# EasyEDA Pro project ProPrj_stm32G474_PPO_Display_2026-02-25.epro

# Schematic Schematic1
Board Name: Board1; Create Date: 2026-02-11; Page Name: P1; Project Name: stm32G474_PPO_Display; Schematic Name: Schematic1; Update Date: 2026-02-24; Company: EasyEDA.com; Page Size: A4; Version: V1.0
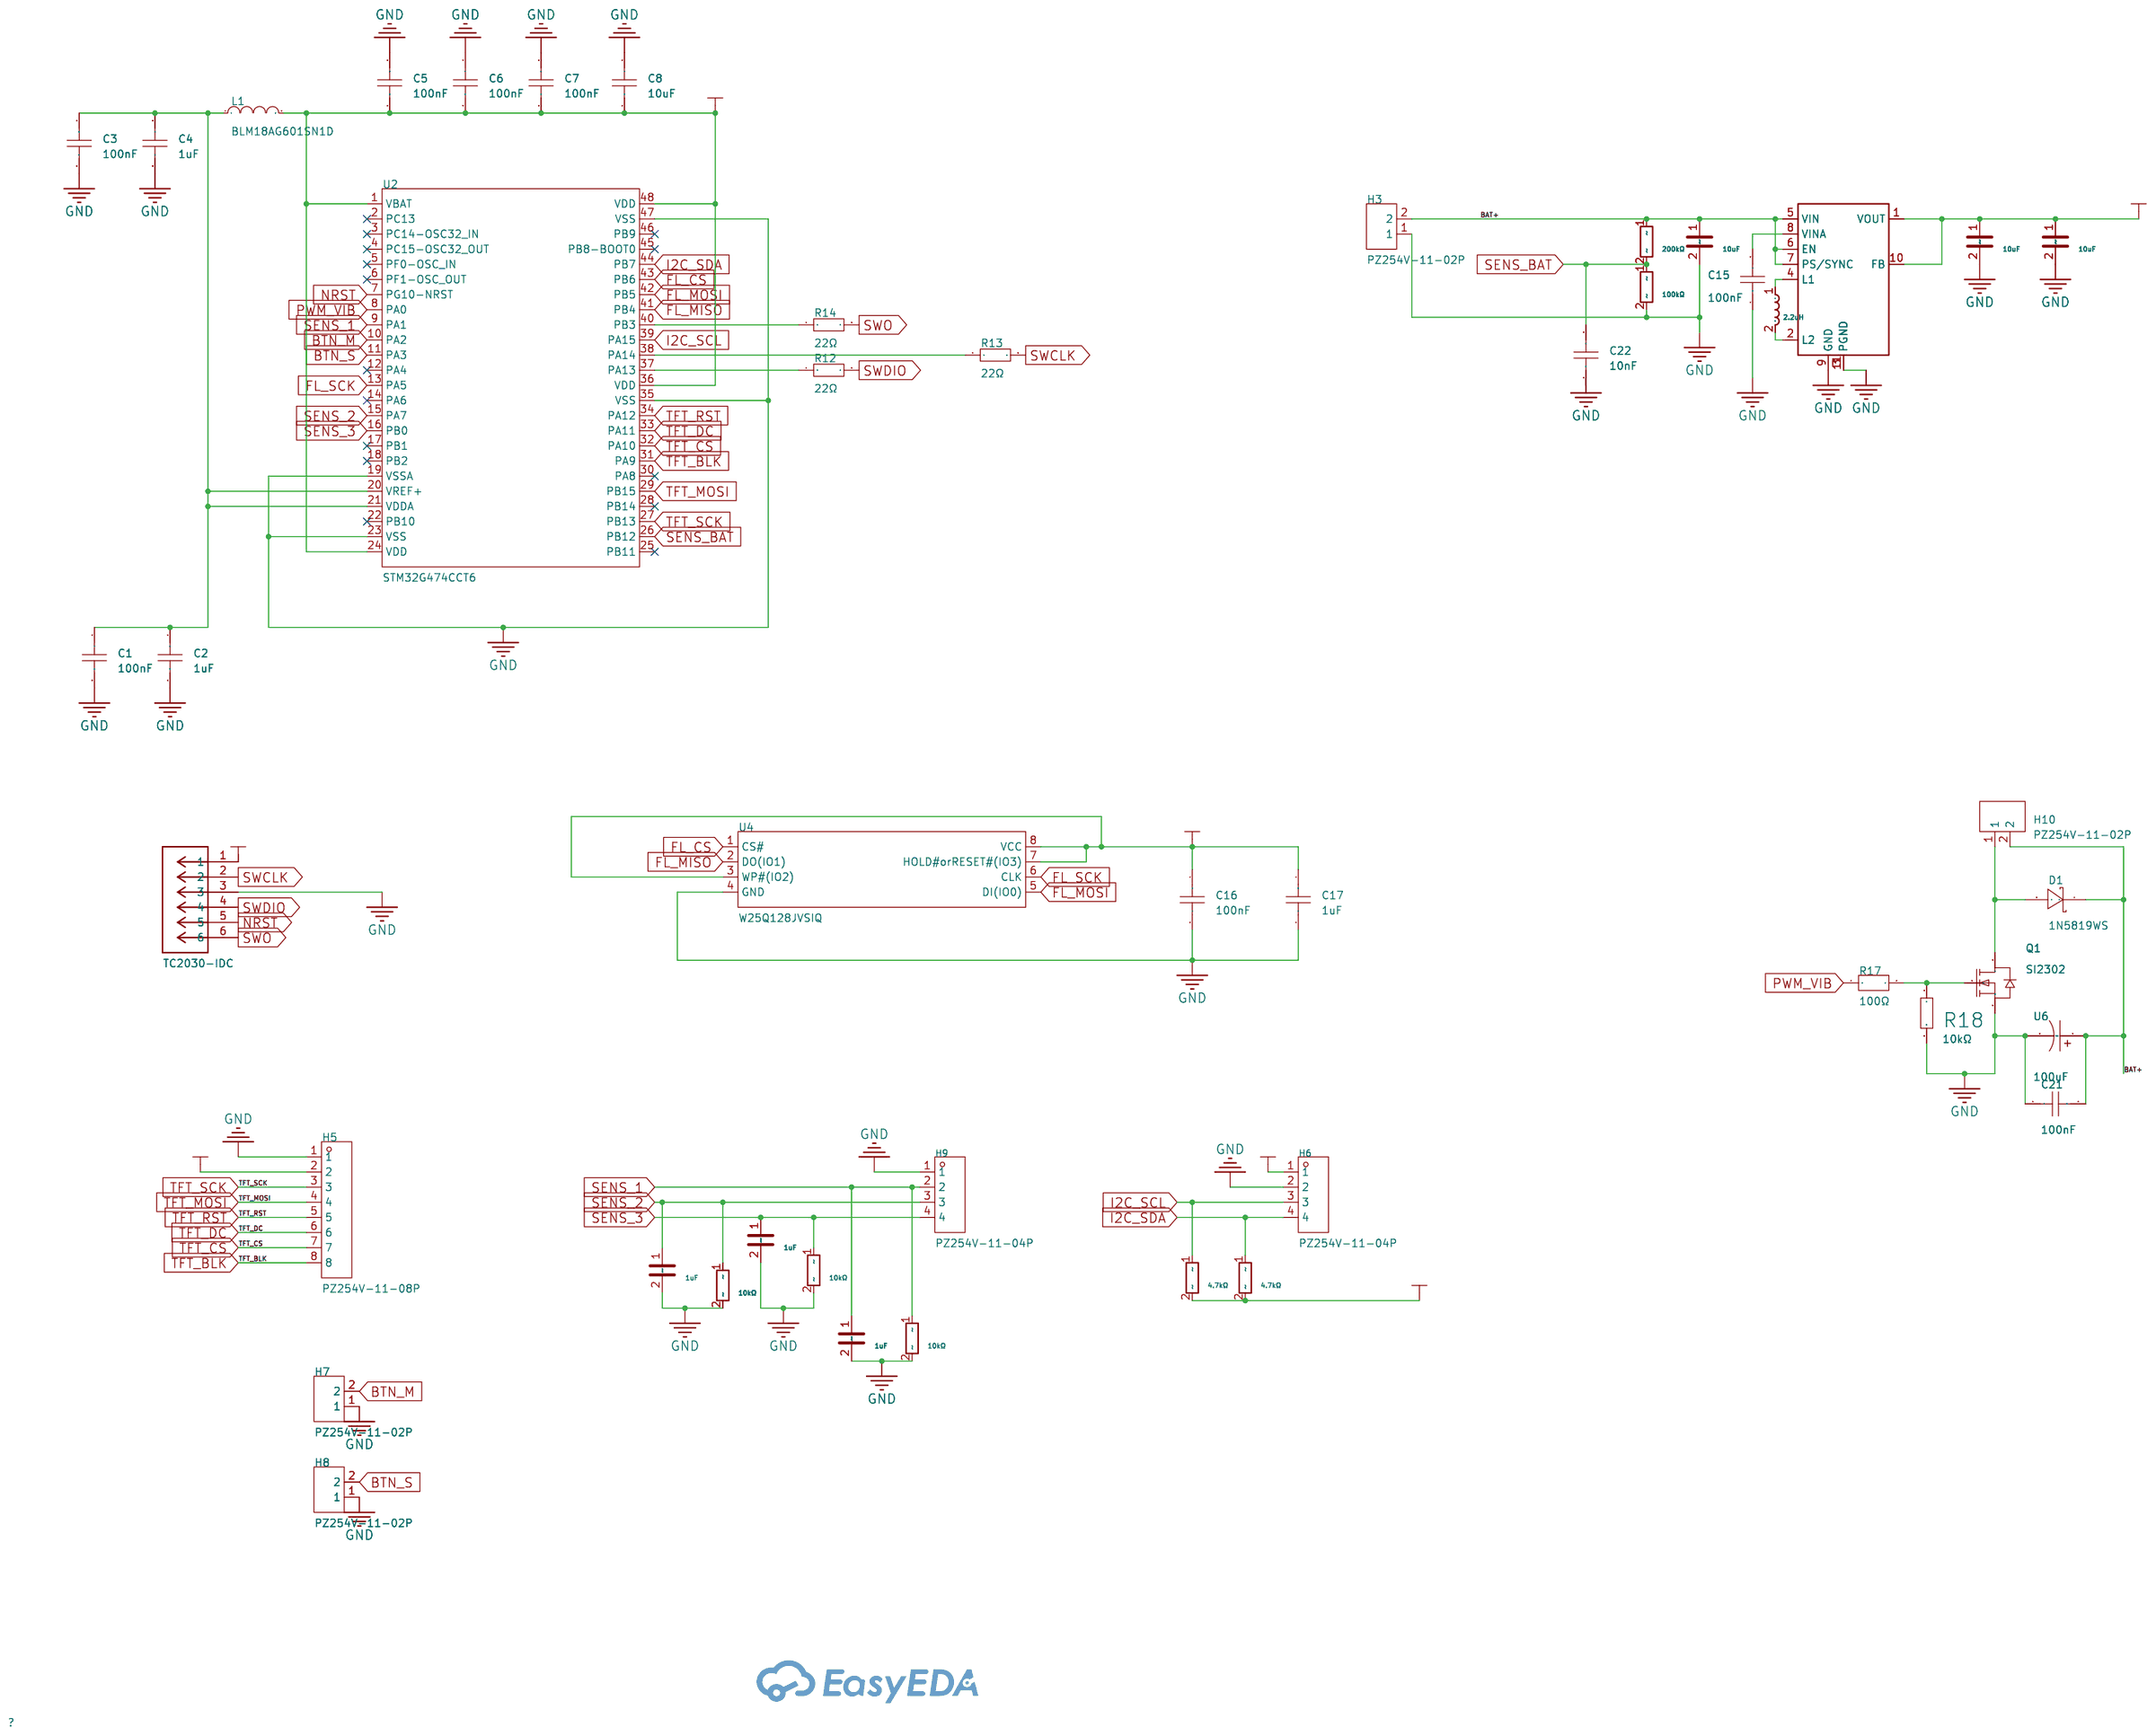
[diagram p0: schematic sheet]

## Parts
C1  100nF  [C0603]
C2  1uF  [C0603]
C3  100nF  [C0603]
C4  1uF  [C0603]
C5  100nF  [C0603]
C6  100nF  [C0603]
C7  100nF  [C0603]
C8  10uF  [C0603]
C9  1uF  [C0603]
C10  10uF  [C0603]
C11  10uF  [C0603]
C15  100nF  [C0603]
C16  100nF  [C0603]
C17  1uF  [C0603]
C18  10uF  [C0603]
C19  1uF  [C0603]
C20  1uF  [C0603]
C21  100nF  [C0603]
C22  10nF  [C0603]
D1  1N5819WS  [SOD-323_L1.8-W1.3-LS2.5-RD]
H3  PZ254V-11-02P  [HDR-TH_2P-P2.54-V-M]  (no BOM)
H5  PZ254V-11-08P  [HDR-TH_8P-P2.54-V-M]  (no BOM)
H6  PZ254V-11-04P  [HDR-TH_4P-P2.54-V-M]  (no BOM)
H7  PZ254V-11-02P  [HDR-TH_2P-P2.54-V-M]  (no BOM)
H8  PZ254V-11-02P  [HDR-TH_2P-P2.54-V-M]  (no BOM)
H9  PZ254V-11-04P  [HDR-TH_4P-P2.54-V-M]  (no BOM)
H10  PZ254V-11-02P  [HDR-TH_2P-P2.54-V-M]  (no BOM)
L1  BLM18AG601SN1D  [L0603]
L2  2.2uH  [IND-SMD_L3.0-W3.0_LQH3NPN2R2NG0L]
Q1  SI2302  [SOT-23-3_L2.9-W1.3-P1.90-LS2.4-BR]
R7  200kΩ  [R0603]
R8  100kΩ  [R0603]
R11  10kΩ  [R0603]
R12  22Ω  [R0603]
R13  22Ω  [R0603]
R14  22Ω  [R0603]
R15  10kΩ  [R0603]
R16  10kΩ  [R0603]
R17  100Ω  [R0603]
R18  10kΩ  [R0603]
R19  4.7kΩ  [R0603]
R20  4.7kΩ  [R0603]
U2  STM32G474CCT6  [LQFP-48_L7.0-W7.0-P0.50-LS9.0-BL]
U3  TPS63031DSKR  [SON-10_L2.5-W2.5-P0.50-TL-EP]
U4  W25Q128JVSIQ  [SOIC-8_L5.3-W5.3-P1.27-LS8.0-BL]
U5  TC2030-IDC  [CONN_TC2030-IDC_TGC]
U6  100uF  [C1206]

## Library data of the parts
C1 C3 C5-C7 C15 C16 C21 = CC0603KRX7R9BB104: Capacitance:100nF Tolerance:±10% Tolerance:±10% Voltage Rating:50V Temperature Coefficient:X7R; LCSC Part Name: 100nF ±10% 50V; Supplier Part: C14663; Manufacturer: YAGEO(国巨); Supplier Footprint: 0603; JLCPCB Part Class: Basic Part; Datasheet: https://item.szlcsc.com/datasheet/CC0603KRX7R9BB104/15331.html; Supplier: LCSC; Tolerance: ±10%; Voltage Rating: 50V; Temperature Coefficient: X7R
C2 C4 C17 = CL10A105KB8NNNC: Capacitance:1uF Tolerance:±10% Tolerance:±10% Voltage Rating:50V Temperature Coefficient:X5R; LCSC Part Name: 1uF ±10% 50V; Supplier Part: C15849; Manufacturer: SAMSUNG(三星); Supplier Footprint: 0603; JLCPCB Part Class: Basic Part; Datasheet: https://item.szlcsc.com/datasheet/CL10A105KB8NNNC/16531.html; Supplier: LCSC; Tolerance: ±10%; Voltage Rating: 50V; Temperature Coefficient: X5R
C8 C10 = CL10A106MQ8NNNC: Capacitance:10uF Tolerance:±20% Tolerance:±20% Voltage Rating:6.3V Temperature Coefficient:X5R; LCSC Part Name: 10uF ±20% 6.3V; Supplier Part: C1691; Manufacturer: SAMSUNG(三星); Supplier Footprint: 0603; JLCPCB Part Class: Extended Part; Datasheet: https://item.szlcsc.com/datasheet/CL10A106MQ8NNNC/2043.html; Supplier: LCSC; Tolerance: ±20%; Voltage Rating: 6.3V; Temperature Coefficient: X5R
C9 C19 C20 = CL10B105KB8NQNC: Capacitance:1uF Tolerance:±10% Tolerance:±10% Voltage Rating:50V Temperature Coefficient:X7R; LCSC Part Name: 1uF ±10% 50V; Supplier Part: C5199872; Manufacturer: SAMSUNG(三星); Supplier Footprint: 0603; JLCPCB Part Class: Extended Part; Datasheet: https://item.szlcsc.com/datasheet/CL10B105KB8NQNC/5885909.html; Supplier: LCSC; Tolerance: ±10%; Voltage Rating: 50V; Temperature Coefficient: X7R
C11 C18 = CL10A106MA8NRNC: Capacitance:10uF Tolerance:±20% Tolerance:±20% Voltage Rating:25V Temperature Coefficient:X5R; LCSC Part Name: 10uF ±20% 25V; Supplier Part: C96446; Manufacturer: SAMSUNG(三星); Supplier Footprint: 0603; JLCPCB Part Class: Basic Part; Datasheet: https://item.szlcsc.com/datasheet/CL10A106MA8NRNC/97651.html; Supplier: LCSC; Tolerance: ±20%; Voltage Rating: 25V; Temperature Coefficient: X5R
C22 = CL10B103KB8NNNC: Capacitance:10nF Tolerance:±10% Tolerance:±10% Voltage Rating:50V Temperature Coefficient:X7R; LCSC Part Name: 10nF ±10% 50V; Supplier Part: C1589; Manufacturer: SAMSUNG(三星); Supplier Footprint: 0603; JLCPCB Part Class: Extended Part; Datasheet: https://item.szlcsc.com/datasheet/CL10B103KB8NNNC/1941.html; Supplier: LCSC; Tolerance: ±10%; Voltage Rating: 50V; Temperature Coefficient: X7R
D1 = 1N5819WS_C191023: Voltage - Forward(Vf@If):600mV@1A Voltage - DC Reverse(Vr):40V Current - Rectified:1A Non-Repetitive Peak Forward Surge Current:25A; LCSC Part Name: 电压:40V 电流:1A; Supplier Part: C191023; Manufacturer: Hottech(合科泰); Supplier Footprint: SOD-323; JLCPCB Part Class: Basic Part; Datasheet: https://item.szlcsc.com/datasheet/1N5819WS/213850.html; Supplier: LCSC; Voltage - Forward(Vf@If): 600mV@1A; Voltage - DC Reverse(Vr): 40V; Current - Rectified: 1A; Non-Repetitive Peak Forward Surge Current: 25A
H3 H7 H8 H10 = PZ254V-11-02P: Pin Structure:1x2P Pitch:2.54mm Row Spacing:- Circluar Pins/Square Pins:Pin Header Mounting Type:Through Hole Number of Rows:1 Number of Pins:2P Current Rating:- Voltage Rating (Max):- Length of Mating Pin:6mm Insulation Height:2.5mm Length of End Connect; LCSC Part Name: 1x2P 间距:2.54mm 方针 直插; Supplier Part: C492401; Manufacturer: XFCN(兴飞); Supplier Footprint: 插件,P=2.54mm; JLCPCB Part Class: Extended Part; Datasheet: https://item.szlcsc.com/datasheet/PZ254V-11-02P/502957.html; Supplier: LCSC; Pin Structure: 1x2P; Pitch: 2.54mm; Circluar Pins/Square Pins: Pin Header; Mounting Type: Through Hole; Number of Rows: 1; Number of Pins: 2P; Length of Mating Pin: 6mm; Insulation Height: 2.5mm; Length of End Connection Pin: 3mm; Contact Material: Brass; Operating Temperature: -40℃~+105℃; Color: Black
H5 = PZ254V-11-08P: Pin Structure:1x8P Pitch:2.54mm Row Spacing:- Circluar Pins/Square Pins:Pin Header Mounting Type:Through Hole Number of Rows:1 Number of Pins:8P Current Rating:- Voltage Rating (Max):- Length of Mating Pin:6mm Insulation Height:2.5mm Length of End Connect; LCSC Part Name: 1x8P 间距:2.54mm 方针 直插; Supplier Part: C492407; Manufacturer: XFCN(兴飞); Supplier Footprint: 插件,P=2.54mm; JLCPCB Part Class: Extended Part; Datasheet: https://item.szlcsc.com/datasheet/PZ254V-11-08P/502963.html; Supplier: LCSC; Pin Structure: 1x8P; Pitch: 2.54mm; Circluar Pins/Square Pins: Pin Header; Mounting Type: Through Hole; Number of Rows: 1; Number of Pins: 8P; Length of Mating Pin: 6mm; Insulation Height: 2.5mm; Length of End Connection Pin: 3mm; Contact Material: Brass; Operating Temperature: -40℃~+105℃; Color: Black
H6 H9 = PZ254V-11-04P: Pin Structure:1x4P Pitch:2.54mm Row Spacing:- Circluar Pins/Square Pins:Pin Header Mounting Type:Through Hole Number of Rows:1 Number of Pins:4P Current Rating:3A Voltage Rating (Max):250V Length of Mating Pin:6mm Insulation Height:2.5mm Length of End Con; LCSC Part Name: 1x4P 间距:2.54mm 方针 直插; Supplier Part: C2691448; Manufacturer: XFCN(兴飞); Supplier Footprint: 插件,P=2.54mm; JLCPCB Part Class: Extended Part; Datasheet: https://item.szlcsc.com/datasheet/PZ254V-11-04P/2801085.html; Supplier: LCSC; Pin Structure: 1x4P; Pitch: 2.54mm; Circluar Pins/Square Pins: Pin Header; Mounting Type: Through Hole; Number of Rows: 1; Number of Pins: 4P; Current Rating: 3A; Voltage Rating (Max): 250V; Length of Mating Pin: 6mm; Insulation Height: 2.5mm; Length of End Connection Pin: 3mm; Operating Temperature: -40℃~+105℃; Color: Black
L1 = BLM18AG601SN1D: Impedance @ Frequency:600Ω@100MHz Tolerance:±25% Tolerance:±25% DC Resistance(DCR):380mΩ Current Rating:500mA Number of Circuits:1 Operating Temperature:-55℃~+125℃ Operating Temperature:-55℃~+125℃; LCSC Part Name: 单路 0603磁珠 阻抗600Ω@100MHz; Supplier Part: C19330; Manufacturer: muRata(村田); Supplier Footprint: 0603; JLCPCB Part Class: Extended Part; Datasheet: https://item.szlcsc.com/datasheet/BLM18AG601SN1D/20038.html; Supplier: LCSC; Impedance @ Frequency: 600Ω@100MHz; Tolerance: ±25%; DC Resistance(DCR): 380mΩ; Current Rating: 500mA; Number of Circuits: 1; Operating Temperature: -55℃~+125℃
L2 = LQH3NPN2R2MMEL: Inductance: Tolerance:±20% Tolerance:±20% Rated Current:1.22A Saturation Current (Isat):1.8A DC Resistance (DCR): Q @ Freq:- Frequency - Self Resonant: Ratings:; LCSC Part Name: 2.2uH ±20% 1.8A; Supplier Part: C668451; Manufacturer: muRata(村田); Supplier Footprint: SMD,3x3mm; JLCPCB Part Class: Extended Part; Datasheet: https://atta.szlcsc.com/upload/public/pdf/source/20191022/C440248_094C93E028FCF0FA66FA57BC1ADCD3EF.pdf; Supplier: LCSC; Tolerance: ±20%; Rated Current: 1.22A; Saturation Current (Isat): 1.8A
Q1 = SI2302_C20628873: Number:1 N-Channel Drain to Source Voltage:20V Current - Continuous Drain(Id):3.3A RDS(on):75mΩ@2.5V Pd - Power Dissipation:1W Gate Threshold Voltage (Vgs(th)):1.5V@250uA Type:N-Channel; LCSC Part Name: 1个N沟道 耐压:20V 电流:3.3A; Supplier Part: C20628873; Manufacturer: FOSAN(富捷/富信); Supplier Footprint: SOT-23; JLCPCB Part Class: Extended Part; Datasheet: https://item.szlcsc.com/datasheet/SI2302/22043121.html; Supplier: LCSC; Number: 1 N-Channel; Drain to Source Voltage: 20V; Current - Continuous Drain(Id): 3.3A; RDS(on): 75mΩ@2.5V; Pd - Power Dissipation: 1W; Gate Threshold Voltage (Vgs(th)): 1.5V@250uA; Type: N-Channel
R7 = 0603WAF2003T5E: Type:Thick Film Resistors Resistance:200kΩ Tolerance:±1% Tolerance:±1% Power(Watts): Overload Voltage (Max): Temperature Coefficient:±100ppm/℃ Temperature Coefficient:±100ppm/℃ Operating Temperature Range:-55℃~+155℃ Operating Temperature Range:-55℃~+155℃; LCSC Part Name: 200kΩ ±1% 100mW 厚膜电阻; Supplier Part: C25811; Manufacturer: UNI-ROYAL(厚声); Supplier Footprint: 0603; JLCPCB Part Class: Basic Part; Datasheet: https://atta.szlcsc.com/upload/public/pdf/source/20200306/C422600_1E6D84923E4A46A82E41ADD87F860B5C.pdf; Supplier: LCSC; Type: Thick Film Resistors; Tolerance: ±1%; Temperature Coefficient: ±100ppm/℃; Operating Temperature Range: -55℃~+155℃
R8 = FRC0603J104 TS: Type:Thick Film Resistor Resistance:100kΩ Tolerance:±5% Tolerance:±5% Power(Watts):100mW Voltage-Supply(Max):75V Temperature Coefficient:±100ppm/℃ Temperature Coefficient:±100ppm/℃ Operating Temperature:-55℃~+155℃ Operating Temperature:-55℃~+155℃; LCSC Part Name: 100kΩ ±5% 100mW 厚膜电阻; Supplier Part: C2907088; Manufacturer: FOJAN(富捷); Supplier Footprint: 0603; JLCPCB Part Class: Extended Part; Supplier: LCSC; Type: Thick Film Resistor; Tolerance: ±5%; Power(Watts): 100mW; Voltage-Supply(Max): 75V; Temperature Coefficient: ±100ppm/℃; Operating Temperature: -55℃~+155℃
R11 R15 R16 R18 = 0603WAF1002T5E: Type:Thick Film Resistor Resistance:10kΩ Tolerance:±1% Tolerance:±1% Power(Watts):100mW Voltage-Supply(Max):75V Temperature Coefficient:±100ppm/℃ Temperature Coefficient:±100ppm/℃ Operating Temperature:-55℃~+155℃ Operating Temperature:-55℃~+155℃; LCSC Part Name: 厚膜电阻 10kΩ ±1% 100mW; Supplier Part: C25804; Manufacturer: UNI-ROYAL(厚声); Supplier Footprint: 0603; JLCPCB Part Class: Basic Part; Datasheet: https://item.szlcsc.com/datasheet/0603WAF1002T5E/26547.html; Supplier: LCSC; Type: Thick Film Resistor; Tolerance: ±1%; Power(Watts): 100mW; Voltage-Supply(Max): 75V; Temperature Coefficient: ±100ppm/℃; Operating Temperature: -55℃~+155℃
R12-R14 = 0603WAF220JT5E: Type:Thick Film Resistors Resistance:22Ω Tolerance:±1% Tolerance:±1% Power(Watts): Overload Voltage (Max): Temperature Coefficient:±100ppm/℃ Temperature Coefficient:±100ppm/℃ Operating Temperature Range:-55℃~+155℃ Operating Temperature Range:-55℃~+155℃; LCSC Part Name: 22Ω ±1% 100mW 厚膜电阻; Supplier Part: C23345; Manufacturer: UNI-ROYAL(厚声); Supplier Footprint: 0603; JLCPCB Part Class: Basic Part; Datasheet: https://atta.szlcsc.com/upload/public/pdf/source/20200306/C422600_1E6D84923E4A46A82E41ADD87F860B5C.pdf; Supplier: LCSC; Type: Thick Film Resistors; Tolerance: ±1%; Temperature Coefficient: ±100ppm/℃; Operating Temperature Range: -55℃~+155℃
R17 = FRC0603J101 TS: Type:Thick Film Resistor Resistance:100Ω Tolerance:±5% Tolerance:±5% Power(Watts):100mW Voltage-Supply(Max):75V Temperature Coefficient:±100ppm/℃ Temperature Coefficient:±100ppm/℃ Operating Temperature:-55℃~+155℃ Operating Temperature:-55℃~+155℃; LCSC Part Name: 100Ω ±5% 100mW 厚膜电阻; Supplier Part: C2907089; Manufacturer: FOJAN(富捷); Supplier Footprint: 0603; JLCPCB Part Class: Extended Part; Supplier: LCSC; Type: Thick Film Resistor; Tolerance: ±5%; Power(Watts): 100mW; Voltage-Supply(Max): 75V; Temperature Coefficient: ±100ppm/℃; Operating Temperature: -55℃~+155℃
R19 R20 = 0603WAF4701T5E: Type:Thick Film Resistor Resistance:4.7kΩ Tolerance:±1% Tolerance:±1% Power(Watts):100mW Voltage-Supply(Max):75V Temperature Coefficient:±100ppm/℃ Temperature Coefficient:±100ppm/℃ Operating Temperature:-55℃~+155℃ Operating Temperature:-55℃~+155℃; LCSC Part Name: 4.7kΩ ±1% 100mW 厚膜电阻; Supplier Part: C23162; Manufacturer: UNI-ROYAL(厚声); Supplier Footprint: 0603; JLCPCB Part Class: Basic Part; Datasheet: https://item.szlcsc.com/datasheet/0603WAF4701T5E/23889.html; Supplier: LCSC; Type: Thick Film Resistor; Tolerance: ±1%; Power(Watts): 100mW; Voltage-Supply(Max): 75V; Temperature Coefficient: ±100ppm/℃; Operating Temperature: -55℃~+155℃
U2 = STM32G474CCT6: CPU Core:ARM-M4 CPU Maximum Speed:170MHz Program Storage Size:256KB Number of I/O:38 ADC (Bit):12bit DAC (Bit):12bit Voltage - Supply:1.71V~3.6V Voltage - Supply:1.71V~3.6V Applications:-; LCSC Part Name: 带DSP和FPU的170MHz主流ARM Cortex-M4 MCU，具有256 KB Flash存储器、数学加速器、高分辨率定时器和高模拟电平集成; Supplier Part: C730124; Manufacturer: ST(意法半导体); Supplier Footprint: LQFP-48(7x7); JLCPCB Part Class: Extended Part; Datasheet: https://item.szlcsc.com/datasheet/STM32G474CCT6/778079.html; Supplier: LCSC; CPU Core: ARM-M4; CPU Maximum Speed: 170MHz; Program Storage Size: 256KB; Number of I/O: 38; ADC (Bit): 12bit; DAC (Bit): 12bit; Voltage - Supply: 1.71V~3.6V
U3 = TPS63031DSKR: Function:Buck-Boost Voltage - Supply:1.8V~5.5V Voltage - Supply:1.8V~5.5V Output Voltage:3.3V Output Voltage:3.3V Output Current:900mA Frequency - Switching:2.4MHz Frequency - Switching:2.4MHz Operating Temperature:-40℃~+125℃@(TJ) Operating Temperature:-4; LCSC Part Name: 高效单电感降 压-升压转换器; Supplier Part: C15516; Manufacturer: TI(德州仪器); Supplier Footprint: SON-10-EP(2.5x2.5); JLCPCB Part Class: Extended Part; Datasheet: https://www.ti.com/cn/lit/gpn/tps63031; Supplier: LCSC; Function: Buck-Boost; Voltage - Supply: 1.8V~5.5V; Output Voltage: 3.3V; Output Current: 900mA; Frequency - Switching: 2.4MHz; Operating Temperature: -40℃~+125℃@(TJ); Synchronous Rectifier: Yes; Number of Outputs: 1; Topology: Buck-Boost; Quiescent Current: 25uA; Switch tube (built-in/external): Built-in; Output Type: Fixed
U4 = W25Q128JVSIQ_C113767: Interface:SPI Memory Size:- Clock Frequency:133MHz Voltage - Supply:2.7V~3.6V Voltage - Supply:2.7V~3.6V Program / Erase Cycles:100,000 Cycles Page Programming Time (Tpp):3ms Operating Temperature:- Operating Temperature:-; LCSC Part Name: 支持双路/四路SPI接口的3V、128Mbit 串行闪存; Supplier Part: C113767; Manufacturer: Winbond(华邦); Supplier Footprint: SOIC-8-208mil; JLCPCB Part Class: Extended Part; Datasheet: https://item.szlcsc.com/datasheet/W25Q128JVSIQ/115003.html; Supplier: LCSC; Interface: SPI; Clock Frequency: 133MHz; Voltage - Supply: 2.7V~3.6V; Program / Erase Cycles: 100,000 Cycles; Page Programming Time (Tpp): 3ms
U5 = TC2030-IDC
U6 = CL31A107MQHNNNE: Capacitance:100uF Tolerance:±20% Tolerance:±20% Voltage Rating:6.3V Temperature Coefficient:X5R; LCSC Part Name: 100uF ±20% 6.3V; Supplier Part: C15008; Manufacturer: SAMSUNG(三星); Supplier Footprint: 1206; JLCPCB Part Class: Basic Part; Datasheet: https://item.szlcsc.com/datasheet/CL31A107MQHNNNE/15681.html; Supplier: LCSC; Tolerance: ±20%; Voltage Rating: 6.3V; Temperature Coefficient: X5R

## Nets
GND: C1.2 C2.2 C3.2 C4.2 C5.1 C6.1 C7.1 C8.1 C9.2 C10.2 C11.2 C15.1 C16.2 C17.2 C18.2 C19.2 C20.2 C21.1 C22.1 H3.1 H5.1 H6.2 H7.1 H8.1 H9.1 Q1.2(S) R8.2 R11.2 R15.2 R16.2 R18.2 U2.19(VSSA) U2.23(VSS) U2.35(VSS) U2.47(VSS) U3.3(PGND) U3.9(GND) U3.11(PGND) U4.4(GND) U5.3 U6.2
VDD: C5.2 C6.2 C7.2 C8.2 C11.1 C16.1 C17.1 C18.1 H5.2 H6.1 L1.2 R19.2 R20.2 U2.1(VBAT) U2.24(VDD) U2.36(VDD) U2.48(VDD) U3.1(VOUT) U3.10(FB) U4.3(WP#(IO2)) U4.7(HOLD#orRESET#(IO3)) U4.8(VCC) U5.1
BAT+: C10.1 C21.2 D1.1(K) H3.2 H10.2 R7.1 U3.5(VIN) U3.6(EN) U3.7(PS/SYNC) U6.1
BTN_M: H7.2 U2.10(PA2)
BTN_S: H8.2 U2.11(PA3)
FL_CS: U2.43(PB6) U4.1(CS#)
FL_MISO: U2.41(PB4) U4.2(DO(IO1))
FL_MOSI: U2.42(PB5) U4.5(DI(IO0))
FL_SCK: U2.13(PA5) U4.6(CLK)
I2C_SCL: H6.3 R19.1 U2.39(PA15)
I2C_SDA: H6.4 R20.1 U2.44(PB7)
NRST: U2.7(PG10-NRST) U5.5
PWM_VIB: R17.1 U2.8(PA0)
SENS_1: C9.1 H9.2 R16.1 U2.9(PA1)
SENS_2: C19.1 H9.3 R11.1 U2.15(PA7)
SENS_3: C20.1 H9.4 R15.1 U2.16(PB0)
SENS_BAT: C22.2 R7.2 R8.1 U2.26(PB12)
SWCLK: R13.2 U5.2
SWDIO: R12.2 U5.4
SWO: R14.2 U5.6
TFT_BLK: H5.8 U2.31(PA9)
TFT_CS: H5.7 U2.32(PA10)
TFT_DC: H5.6 U2.33(PA11)
TFT_MOSI: H5.4 U2.29(PB15)
TFT_RST: H5.5 U2.34(PA12)
TFT_SCK: H5.3 U2.27(PB13)
$1N885: C1.1 C2.1 C3.1 C4.1 L1.1 U2.20(VREF+) U2.21(VDDA)
$1N2112: L2.2 U3.2(L2)
$1N2115: L2.1 U3.4(L1)
$1N3846: R12.1 U2.37(PA13)
$1N3850: R13.1 U2.38(PA14)
$1N3855: R14.1 U2.40(PB3)
$1N9387: Q1.1(G) R17.2 R18.1
$1N9552: D1.2(A) H10.1 Q1.3(D)
$1N11685: C15.2 U3.8(VINA)

Not connected (* = marked no-connect by the designer): U2 2(PC13)* 3(PC14-OSC32_IN)* 4(PC15-OSC32_OUT)* 5(PF0-OSC_IN)* 6(PF1-OSC_OUT)* 12(PA4)* 14(PA6)* 17(PB1)* 18(PB2)* 22(PB10)* 25(PB11)* 28(PB14)* 30(PA8)* 45(PB8-BOOT0)* 46(PB9)*

# Board PCB1
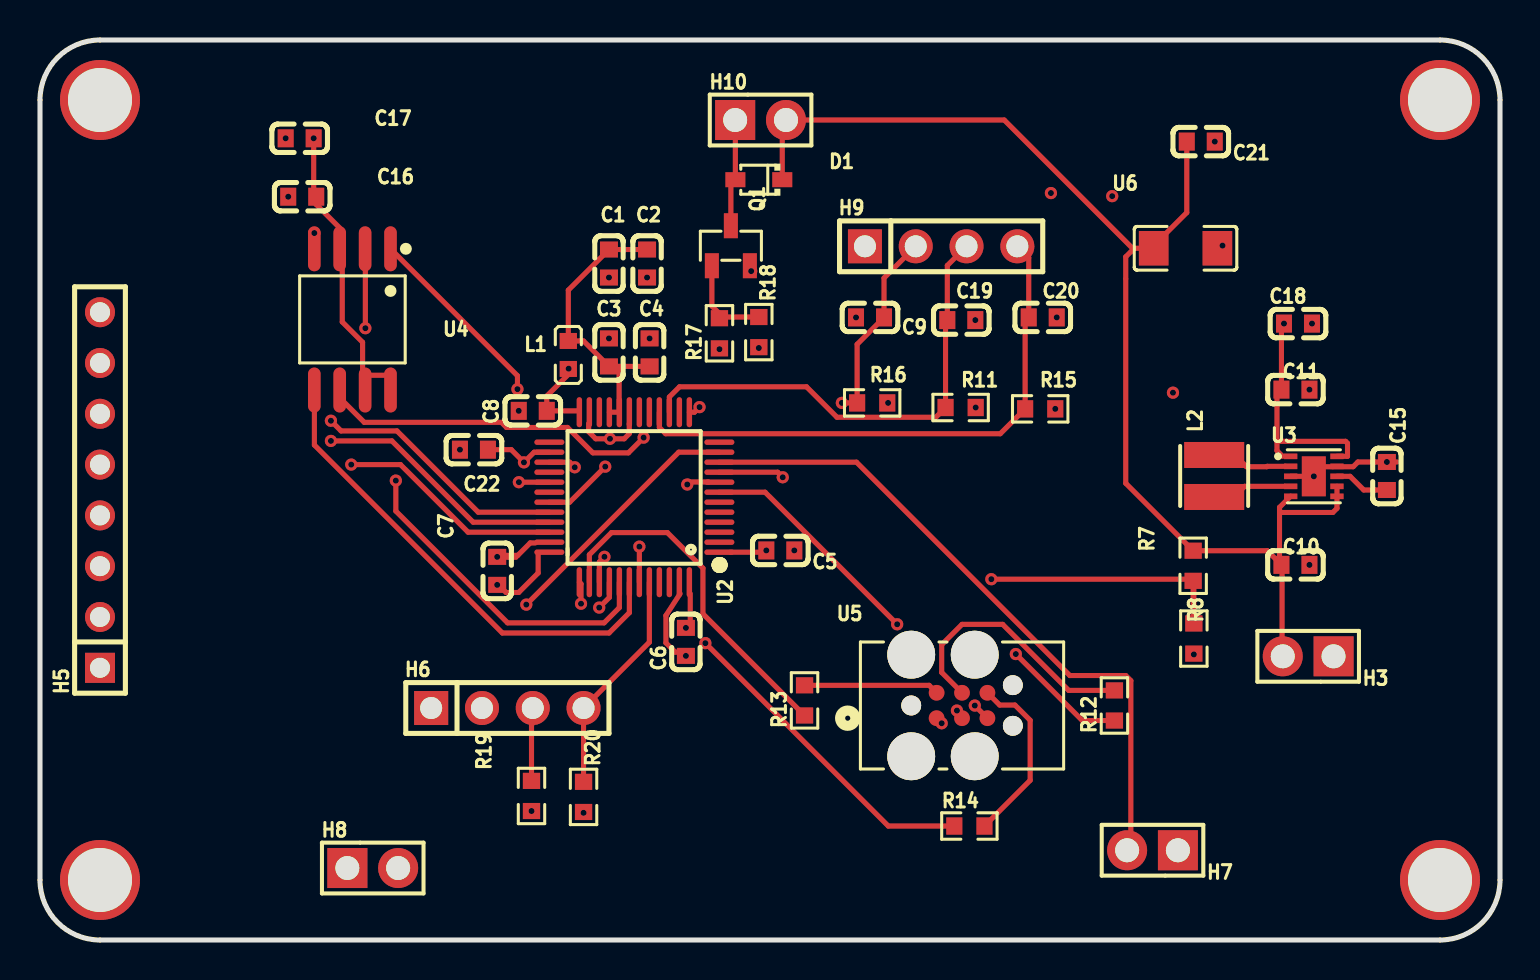
[diagram p1: board, top side]
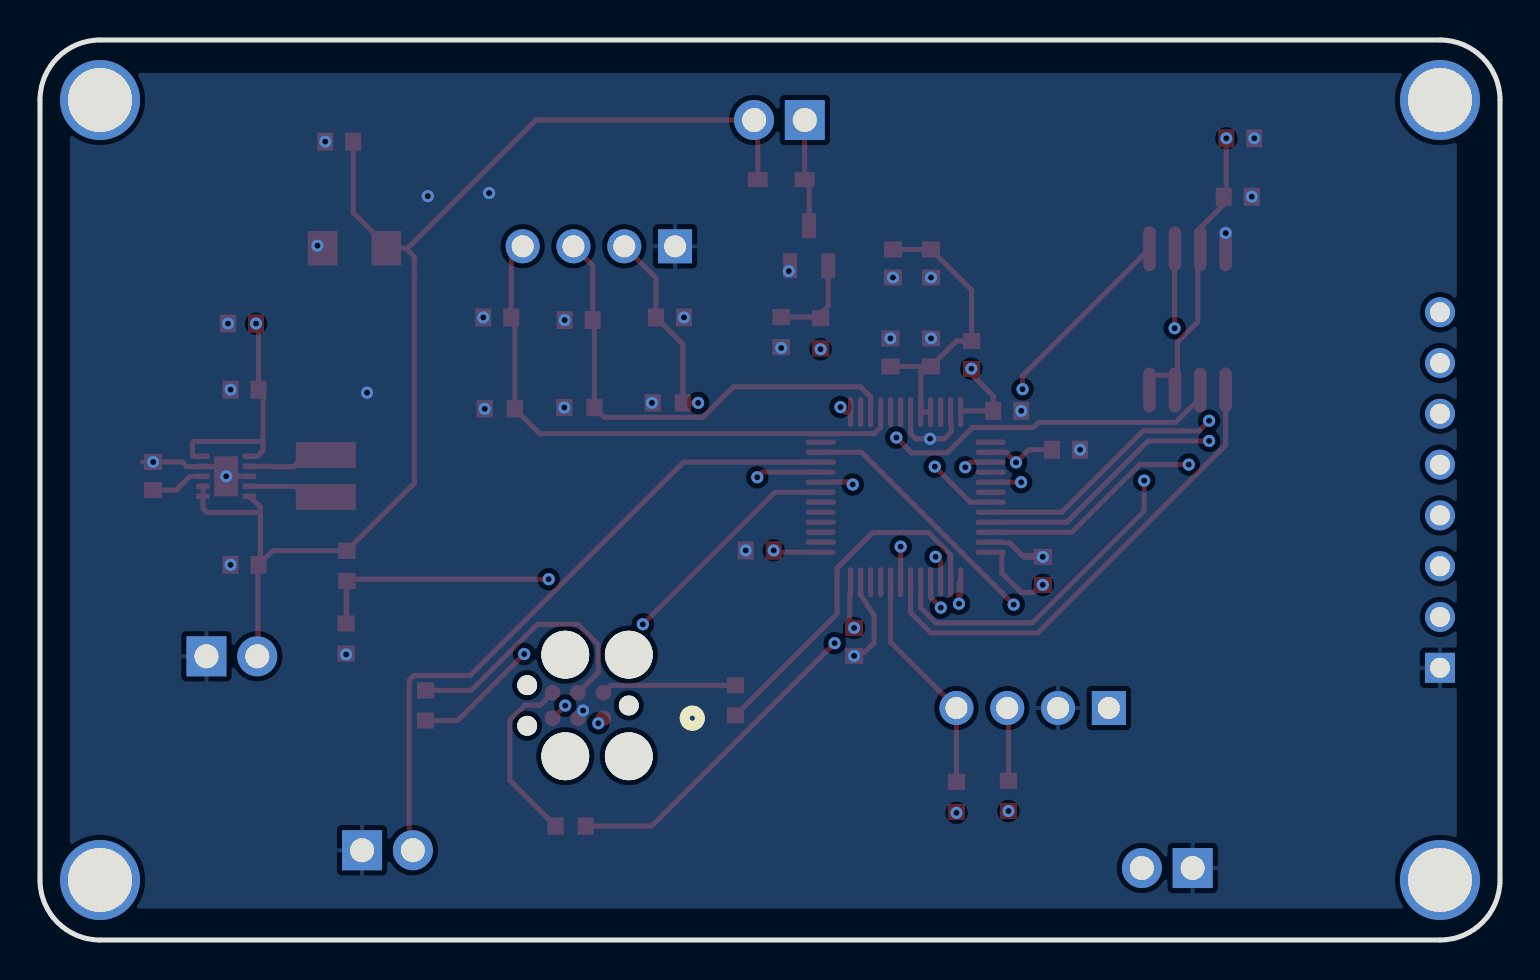
[diagram p2: board, bottom side, seen from below]

Outline 73 x 45 mm; copper layers: Top Layer, Inner1, Inner2, Bottom Layer. Coordinates in mm from the lower left corner of the outline.
Outline path: 0,42 0,3 arc(0.88,0.88) 3,0 70,0 arc(72.12,0.88) 73,3 73,42 arc(72.12,44.12) 70,45 3,45 arc(0.88,44.12) 0,42
Stack: Top Layer 0.035mm Outer layer thickness 1oz / Dielectric1 0.2104mm 7628 RC49% 8.6mil / Inner1 0.0152mm Inner layer thickness / Dielectric2 1.065mm 1.1mm H/HOZ Copper / Inner2 0.0152mm Inner layer thickness / Dielectric3 0.2104mm 7628 RC49% 8.6mil / Bottom Layer 0.035mm Outer layer thickness 1oz

## Design rules (mm)
template: JLCPCB Capability(Multiple Layers Board)
spacing copperThickness1oz (default): track to track 0.102, other pairs 0.152 to 0.3
spacing copperThickness2oz: track to track 0.203, other pairs 0.152 to 0.3
spacing copperThicknessInner0.5oz: track to track 0.089, other pairs 0.152 to 0.3
track width copperThickness1oz (default): min 0.102, default 0.254, max 2.54
track width copperThickness2oz: min 0.203, default 0.254, max 2.54
track width copperThickness0.5oz: min 0.089, default 0.254, max 2.54
differential pair differentialPair (default): width min 0.127, default 0.254, max 2.54; gap min 0.152, default 0.152
via viaSize (default): diameter min 0.3, default 0.61, max 10; hole min 0.2, default 0.305, max 6.3

## Placement (name value [footprint] x y rotation side)
C1  100nF  [C0603]  28.45 33.82 270 top
C2  1uF  [C0603]  30.35 33.82 270 top
C3  100nF  [C0603]  28.45 29.38 90 top
C4  1uF  [C0603]  30.48 29.38 90 top
C5  100nF  [C0603]  37.02 19.48 180 top
C6  100nF  [C0603]  32.29 14.91 90 top
C7  100nF  [C0603]  22.86 18.46 270 top
C8  10uF  [C0603]  24.64 26.46 0 top
C9  1uF  [C0603]  41.5 31.13 180 top
C10  10uF  [C0603]  62.77 18.76 0 top
C11  10uF  [C0603]  62.77 27.52 0 top
C15  100nF  [C0603]  67.34 23.2 270 top
C16  100nF  [C0603]  13.11 37.16 180 top
C17  1uF  [C0603]  12.98 40.09 180 top
C18  10uF  [C0603]  62.9 30.82 0 top
C19  1uF  [C0603]  46.07 31 0 top
C20  1uF  [C0603]  50.14 31.13 0 top
C21  100nF  [C0603]  58.04 39.92 180 top
C22  10nF  [C0603]  21.7 24.52 0 top
D1  1N5819WS  [SOD-323_L1.8-W1.3-LS2.5-RD]  35.94 38.02 180 top
H3  PZ254V-11-02P  [HDR-TH_2P-P2.54-V-M]  63.41 14.18 180 top
H5  PZ254V-11-08P  [HDR-TH_8P-P2.54-V-M]  3 22.5 90 top
H6  PZ254V-11-04P  [HDR-TH_4P-P2.54-V-M]  23.37 11.6 0 top
H7  PZ254V-11-02P  [HDR-TH_2P-P2.54-V-M]  55.63 4.49 180 top
H8  PZ254V-11-02P  [HDR-TH_2P-P2.54-V-M]  16.64 3.6 0 top
H9  PZ254V-11-04P  [HDR-TH_4P-P2.54-V-M]  45.06 34.69 0 top
H10  PZ254V-11-02P  [HDR-TH_2P-P2.54-V-M]  36.03 41 0 top
L1  BLM18AG601SN1D  [L0603]  26.42 29.25 270 top
L2  2.2uH  [IND-SMD_L3.0-W3.0_LQH3NPN2R2NG0L]  58.71 23.2 90 top
NOREF  -  [Pad_e61]  70 42 0 top
NOREF#2  -  [Pad_e62]  70 3 0 top
NOREF#3  -  [Pad_e63]  3 3 0 top
NOREF#4  -  [Pad_e59]  3 42 0 top
Q1  SI2302  [SOT-23-3_L2.9-W1.3-P1.90-LS2.4-BR]  34.54 34.71 270 top
R7  200kΩ  [R0603]  57.66 18.71 270 top
R8  100kΩ  [R0603]  57.69 15.07 270 top
R11  10kΩ  [R0603]  46.03 26.62 0 top
R12  22Ω  [R0603]  53.72 11.73 90 top
R13  22Ω  [R0603]  38.23 11.98 90 top
R14  22Ω  [R0603]  46.47 5.7 0 top
R15  10kΩ  [R0603]  50.01 26.56 0 top
R16  10kΩ  [R0603]  41.61 26.86 0 top
R17  100Ω  [R0603]  33.97 30.34 90 top
R18  10kΩ  [R0603]  35.94 30.39 270 top
R19  4.7kΩ  [R0603]  24.58 7.2 270 top
R20  4.7kΩ  [R0603]  27.18 7.15 270 top
U2  STM32G474CCT6  [LQFP-48_L7.0-W7.0-P0.50-LS9.0-BL]  29.72 22.14 90 top
U3  TPS63031DSKR  [SON-10_L2.5-W2.5-P0.50-TL-EP]  63.69 23.18 0 top
U4  W25Q128JVSIQ  [SOIC-8_L5.3-W5.3-P1.27-LS8.0-BL]  15.62 31.03 180 top
U5  TC2030-IDC  [CONN_TC2030-IDC_TGC]  46.1 11.73 0 top
U6  100uF  [C1206]  57.28 34.59 0 top

## Footprints (pads in the part's own frame, mm; a bottom-side part is the same pattern mirrored in y, then rotated)
C0603
  rect 0.8x0.9 smd: 1(-0.7,0) 2(0.7,0)
C1206
  rect 1.485x1.728 smd: 1(-1.593,0) 2(1.593,0)
CONN_TC2030-IDC_TGC
  round 0.787 smd: 1(-1.27,-0.635) 2(-1.27,0.635) 3(0,-0.635) 4(0,0.635) 5(1.27,-0.635) 6(1.27,0.635)
  round 0.991 hole 0.991: 7(-2.54,0) 8(2.54,1.016) 9(2.54,-1.016)
  round 2.388 hole 2.388: 10(-2.54,2.54) 11(0.635,2.54) 12(-2.54,-2.54) 13(0.635,-2.54)
HDR-TH_2P-P2.54-V-M
  rect 2x2 hole 1.2: 1(-1.27,0)
  round 2 hole 1.2: 2(1.27,0)
HDR-TH_4P-P2.54-V-M
  rect 1.7x1.7 hole 1.1: 1(-3.81,0)
  round 1.7 hole 1.1: 2(-1.27,0) 3(1.27,0) 4(3.81,0)
HDR-TH_8P-P2.54-V-M
  rect 1.5x1.5 hole 1: 1(-8.89,0)
  round 1.5 hole 1: 2(-6.35,0) 3(-3.81,0) 4(-1.27,0) 5(1.27,0) 6(3.81,0) 7(6.35,0) 8(8.89,0)
IND-SMD_L3.0-W3.0_LQH3NPN2R2NG0L
  rect 1.3x3 smd: 1(-1.05,0) 2(1.05,0)
L0603
  rect 0.8x0.864 smd: 1(-0.7,0) 2(0.7,0)
LQFP-48_L7.0-W7.0-P0.50-LS9.0-BL
  oval 0.27x1.5 smd: 1(-2.75,-4.25) 2(-2.25,-4.25) 3(-1.75,-4.25) 4(-1.25,-4.25) 5(-0.75,-4.25) 6(-0.25,-4.25) 7(0.25,-4.25) 8(0.75,-4.25) 9(1.25,-4.25) 10(1.75,-4.25) 11(2.25,-4.25) 12(2.75,-4.25) 25(2.75,4.25) 26(2.25,4.25) 27(1.75,4.25) 28(1.25,4.25) 29(0.75,4.25) 30(0.25,4.25) 31(-0.25,4.25) 32(-0.75,4.25) 33(-1.25,4.25) 34(-1.75,4.25) 35(-2.25,4.25) 36(-2.75,4.25)
  oval 1.5x0.27 smd: 13(4.25,-2.75) 14(4.25,-2.25) 15(4.25,-1.75) 16(4.25,-1.25) 17(4.25,-0.75) 18(4.25,-0.25) 19(4.25,0.25) 20(4.25,0.75) 21(4.25,1.25) 22(4.25,1.75) 23(4.25,2.25) 24(4.25,2.75) 37(-4.25,2.75) 38(-4.25,2.25) 39(-4.25,1.75) 40(-4.25,1.25) 41(-4.25,0.75) 42(-4.25,0.25) 43(-4.25,-0.25) 44(-4.25,-0.75) 45(-4.25,-1.25) 46(-4.25,-1.75) 47(-4.25,-2.25) 48(-4.25,-2.75)
Pad_e59
  round 4 hole 3.2: 2(0,0)
Pad_e61
  round 4 hole 3.2: 2(0,0)
Pad_e62
  round 4 hole 3.2: 2(0,0)
Pad_e63
  round 4 hole 3.2: 2(0,0)
R0603
  rect 0.806x0.864 smd: 1(-0.753,0) 2(0.753,0)
SOD-323_L1.8-W1.3-LS2.5-RD
  rect 1x0.75 smd: 1(-1.173,0) 2(1.173,0)
SOIC-8_L5.3-W5.3-P1.27-LS8.0-BL
  oval 0.63x2.25 smd: 1(-1.905,-3.53) 2(-0.635,-3.53) 3(0.635,-3.53) 4(1.905,-3.53) 5(1.905,3.53) 6(0.635,3.53) 7(-0.635,3.53) 8(-1.905,3.53)
SON-10_L2.5-W2.5-P0.50-TL-EP
  rect 0.665x0.28 smd: 1(-1.157,1) 2(-1.157,0.5) 3(-1.157,0) 4(-1.157,-0.5) 5(-1.157,-1) 6(1.157,-1) 7(1.157,-0.5) 8(1.157,0) 9(1.157,0.5) 10(1.157,1)
  rect 1.2x2 smd: 11(0,0)
SOT-23-3_L2.9-W1.3-P1.90-LS2.4-BR
  rect 1.25x0.7 smd: 1(1,-0.95) 2(1,0.95) 3(-1,0)

## Nets
As in the schematic.

Pads without a net: NOREF 2; NOREF#2 2; NOREF#3 2; NOREF#4 2; U2 2 3 4 5 6 12 14 17 18 22 25 28 30 45 46; U5 7 8 9 10 11 12 13

## Via types
v1: diameter 0.61, hole 0.305, Top Layer to Bottom Layer, 68 vias

## Routing (per net, layer and track width the routed paths; a pad name or vN(x,y) marks a point on that pad's centre or on a via; arc(x,y) is an arc through that point)
GND: length 14.4
  Top Layer w0.254: 23.8,19.14 23.13,19.14 23.04,19.23 23.89,19.23 24.51,19.85 24.76,19.85 ; 27.43,25.82 27.43,25.42 27.79,25.06 29.21,25.06 29.46,25.31 29.46,25.82 ; 32,14.39 31.76,14.39 31.3,14.86 31.3,16.22 32,17.31 ; U3.3 63.44,23.18 ; 64.01,23.66 65.66,23.66 65.9,23.9 67.85,23.9
  vias: v1(12.28,40.09) v1(12.41,37.16) v1(13.72,35.35) v1(21,24.52) v1(22.86,19.16) v1(23.94,26.46) v1(28.45,33.12) v1(28.45,30.08) v1(28.5,25.06) v1(30.35,33.12) v1(30.48,30.08) v1(32.29,14.21) v1(35.56,33.44) v1(35.94,29.6) v1(37.72,19.48) v1(40.8,31.13) v1(42.4,26.86) v1(45.85,11.47) v1(46.77,31) v1(46.78,26.62) v1(50.55,37.35) v1(50.84,31.13) v1(50.76,26.56) v1(53.61,37.19) v1(56.65,27.37) v1(57.69,14.28) v1(58.74,39.92) v1(59.13,34.72) v1(63.47,27.52) v1(63.47,18.76) v1(63.6,30.82) v1(63.69,23.18) v1(67.34,23.9)
VDD: length 33
  Top Layer w0.254: 13.68,39.69 13.68,37.29 C16.1 13.81,36.78 15.11,35.47 ; 15.11,33.82 15.11,30.9 16.13,29.89 16.13,28.36 16.26,28.24 17.4,28.24 17.53,28.11 ; 23.11,17.57 23.31,17.38 23.93,17.38 24.91,18.35 24.91,19.34 ; 26.41,28.27 25.34,27.2 C8.2 ; 25.72,26.46 26.9,26.46 U2.24 ; 32.51,17.31 32.51,15.61 ; 34.51,19.39 36.15,19.39 36.19,19.35 ; 61.85,24.93 61.85,27.12 ; 61.85,24.93 61.85,24.47 62.13,24.18 ; 61.85,24.93 65.28,24.93 65.38,24.84 65.38,24.18 U3.10 ; 62.07,27.97 62.07,30.82
  vias: v1(13.68,40.09) v1(22.86,17.76) v1(24.58,6.45) v1(26.43,28.57) v1(27.18,6.36) v1(32.29,15.61) v1(36.32,19.48) v1(45.09,10.84) v1(62.2,30.82)
BTN_M: length 33.7
  Top Layer w0.254: U2.10 40.83,23.89 51.49,13.22 54.29,13.22 54.54,12.97 54.54,4.67 H7.2
BTN_S: length 28.6
  Top Layer w0.254: v1(24.32,16.77) 31.94,24.39 U2.11
  Inner1 w0.254: H8.2 20.76,6.45 20.76,13.21 v1(24.32,16.77)
FL_CS: length 21.8
  Top Layer w0.254: U4.1 23.87,28.21 v1(23.87,27.54) ; U2.43 v1(29.97,19.67)
  Inner1 w0.254: v1(23.87,27.54) 27.43,23.99 27.43,22.21 v1(29.97,19.67)
FL_MISO: length 28.8
  Top Layer w0.254: v1(16.27,30.59) 16.27,34.55 U4.2 ; U2.41 28.97,16.62 28.21,15.86 23.38,15.86 17.79,21.45 v1(17.79,22.97)
  Inner1 w0.254: v1(17.79,22.97) 17.79,29.07 v1(16.27,30.59)
FL_MOSI: length 24.3
  Top Layer w0.254: U2.42 29.47,16.37 28.45,15.35 23.12,15.35 13.72,24.75 13.72,27.5
FL_SCK: length 21.1
  Top Layer w0.254: U4.6 14.99,27.11 16.21,25.88 23.07,25.88 23.32,25.63 26.37,25.63 27.64,24.36 29.42,24.36 v1(30.18,25.12) ; v1(32.98,26.64) 32.72,26.39 U2.13
  Inner1 w0.254: v1(32.98,26.64) 31.71,26.64 v1(30.18,25.12)
I2C_SCL: length 13.3
  Top Layer w0.254: 24.64,10.84 24.58,10.77 R19.1 ; v1(28.22,19.16) 27.97,18.91 U2.39
  Inner1 w0.254: H6.3 24.64,15.58 v1(28.22,19.16)
I2C_SDA: length 10.6
  Top Layer w0.254: 27.18,7.95 27.18,10.91 ; H6.4 30.47,14.89 U2.44
NRST: length 19.7
  Top Layer w0.254: v1(42.86,15.79) 36.25,22.39 U2.7 ; v1(46.74,11.72) U5.5
  Inner1 w0.254: v1(46.74,11.72) 46.74,12.23 46.2,12.77 46.12,12.77 45.24,13.65 45.24,13.73 45.14,13.83 45.14,15.28 44.13,16.29 43.37,16.29 v1(42.86,15.79)
PWM_VIB: length 8.6
  Top Layer w0.254: 32.26,22.9 33.41,22.9 33.43,22.89
  Inner1 w0.254: R17.1 33.97,24.39 v1(32.36,22.78)
  vias: v1(33.97,29.54)
SENS_1: length 18
  Top Layer w0.254: 43.79,34.69 42.2,33.1 C9.1 40.86,29.78 R16.1 v1(40.09,26.86) ; U2.9 36.88,23.39 v1(37.14,23.14)
  Inner1 w0.254: v1(40.09,26.86) 37.14,23.9 v1(37.14,23.14)
SENS_2: length 24.1
  Top Layer w0.254: U2.15 31.47,27.15 31.98,27.66 38.33,27.66 39.85,26.14 44.79,26.14 R11.1 45.28,30.91 C19.1 45.37,33.72 H9.3
SENS_3: length 28.1
  Top Layer w0.254: U2.16 30.97,25.63 31.28,25.31 48.01,25.31 R15.1 49.26,30.95 C20.1 49.44,34.11 H9.4
SENS_BAT: length 43.8
  Top Layer w0.254: C22.2 23.56,24.52 v1(24.2,23.88) 24.71,24.39 U2.26 ; v1(47.57,18.04) 57.62,18.04 57.66,18.08 57.69,18.04 R8.1 57.66,15.86 R7.2
  Inner1 w0.254: v1(24.2,23.88) 24.45,23.88 30.29,18.04 v1(47.57,18.04)
SWCLK: length 6.8
  Top Layer w0.254: U5.2 44.46,12.73 R13.2
SWDIO: length 13.2
  Top Layer w0.254: U5.4 45.09,13.38 45.09,14.77 46.1,15.78 48.13,15.78 51.44,12.48 R12.2
SWO: length 8.9
  Top Layer w0.254: U5.6 47.98,11.75 48.75,11.75 49.51,10.99 49.51,7.98 R14.2
TFT_BLK: length 32.3
  Top Layer w0.254: v1(28.26,23.67) 26.48,21.89 U2.31
  Inner1 w0.254: v1(28.26,23.67) 28.26,24.18 21.05,31.39 H5.8
TFT_CS: length 25.6
  Top Layer w0.254: U2.32 21.91,21.39 17.85,25.45 15.05,25.45 v1(14.55,25.96)
  Inner1 w0.254: v1(14.55,25.96) 5.89,25.96 H5.7
TFT_DC: length 24.7
  Top Layer w0.254: v1(14.55,24.95) 17.59,24.95 21.66,20.89 U2.33
  Inner1 w0.254: H5.6 4.36,24.95 v1(14.55,24.95)
TFT_MOSI: length 23.2
  Top Layer w0.254: U2.29 v1(23.94,22.89)
  Inner1 w0.254: H5.4 22.28,21.23 v1(23.94,22.89)
TFT_RST: length 23.9
  Top Layer w0.254: v1(15.56,23.77) 18.02,23.77 21.4,20.39 U2.34
  Inner1 w0.254: v1(15.56,23.77) H5.5
TFT_SCK: length 31.3
  Top Layer w0.254: v1(26.74,23.64) 26.48,23.89 U2.27
  Inner1 w0.254: v1(26.74,23.64) 25.72,24.65 23.94,24.65 21.66,22.37 2.61,22.37 1.85,21.6 1.85,19.84 H5.3
$1N885: length 14.7
  Top Layer w0.254: 28.96,28.68 C4.1 ; 28.96,28.68 C3.1 27.18,29.95 L1.1 26.42,32.49 C1.1 C2.1 ; 28.96,28.68 28.96,26.4 U2.20 U2.21
$1N3846: length 30.7
  Top Layer w0.254: U2.37 27.05,17.81 v1(27.05,16.81) ; R12.1 52.12,10.97 v1(48.79,14.3)
  Inner1 w0.254: v1(48.79,14.3) 48.79,14.38 45.85,17.32 27.56,17.32 v1(27.05,16.81)
$1N3850: length 17.7
  Top Layer w0.254: R13.1 33.15,16.31 33.15,18.59 31.37,20.37 28.57,20.37 27.47,19.26 U2.38
$1N3855: length 23.8
  Top Layer w0.254: U2.40 28.47,17.13 v1(27.96,16.62) ; R14.1 42.41,5.7 v1(33.27,14.84)
  Inner1 w0.254: v1(33.27,14.84) 29.74,14.84 v1(27.96,16.62)
BAT+: length 61.9
  Top Layer w0.254: 37.47,40.43 37.11,40.08 D1.1 ; 37.93,41 48.21,41 54.62,34.59 55.56,34.59 57.34,36.37 C21.2 ; 54.71,34.59 54.29,34.16 54.29,22.83 R7.1 61.36,19.46 C10.1 62.1,18.73 62.1,15.03 ; 62.1,18.71 61.98,18.84 61.98,21.63 62.53,22.18 U3.5 ; 61.98,21.38 64.64,21.38 64.85,21.58 U3.6 U3.7
$1N2112: length 2.5
  Top Layer w0.254: 59.94,24.05 60.32,23.66 61.34,23.66 61.36,23.68 62.29,23.68
$1N2115: length 2.4
  Top Layer w0.254: 59.94,22.39 60.23,22.68 62.24,22.68
$1N9387: length 4.5
  Top Layer w0.254: Q1.1 33.59,31.7 33.97,31.32 ; R18.1 33.97,31.15
$1N9552: length 4.6
  Top Layer w0.254: 34.54,35.87 34.54,37.79 D1.2 34.77,40.08 34.54,40.3
$1N11685: length 2.8
  Top Layer w0.254: U3.8 65.5,23.18 66.19,22.5 C15.2

## Copper pours and planes (outline as drawn; the poured copper is in the pictures)
GND on Bottom Layer: 2.16,43.35 71.5,43.35 71.5,1.57 2.16,1.57
VDD on Inner2: 1.65,43.09 71.25,43.09 71.25,1.31 1.65,1.31
